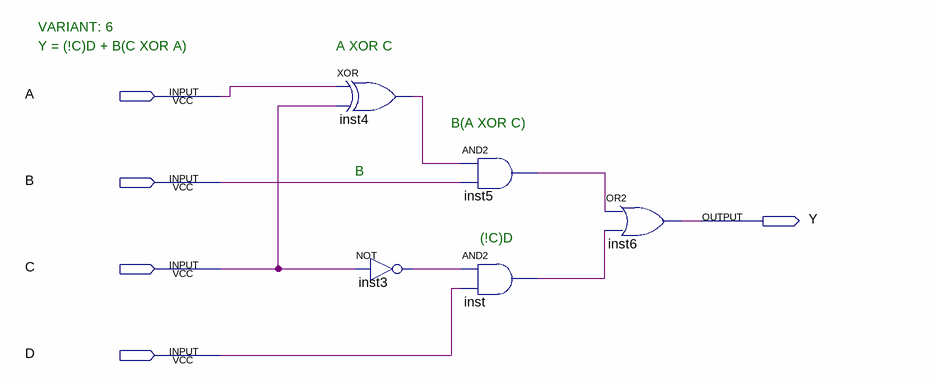
[diagram p0: schematic sheet]
// Quartus schematic lab1_var6.bdf as structural Verilog: 5 symbols, 5 pins
module lab1_var6 (
  input  A,
  input  B,
  input  C,
  input  D,
  output Y
);

  wire inst3_out, inst4_out, inst5_out, inst_out;

  xor inst4 (inst4_out, A, C);
  not inst3 (inst3_out, C);
  and inst5 (inst5_out, inst4_out, B);
  and inst (inst_out, inst3_out, D);
  or inst6 (Y, inst5_out, inst_out);

  // Notes on the sheet:
  //   VARIANT: 6 
  //   Y = (!C)D + B(C XOR A) 
  //   A XOR C
  //   B(A XOR C)
  //   B
  //   (!C)D
endmodule
